# Altium project PCB_Project.PrjPcb
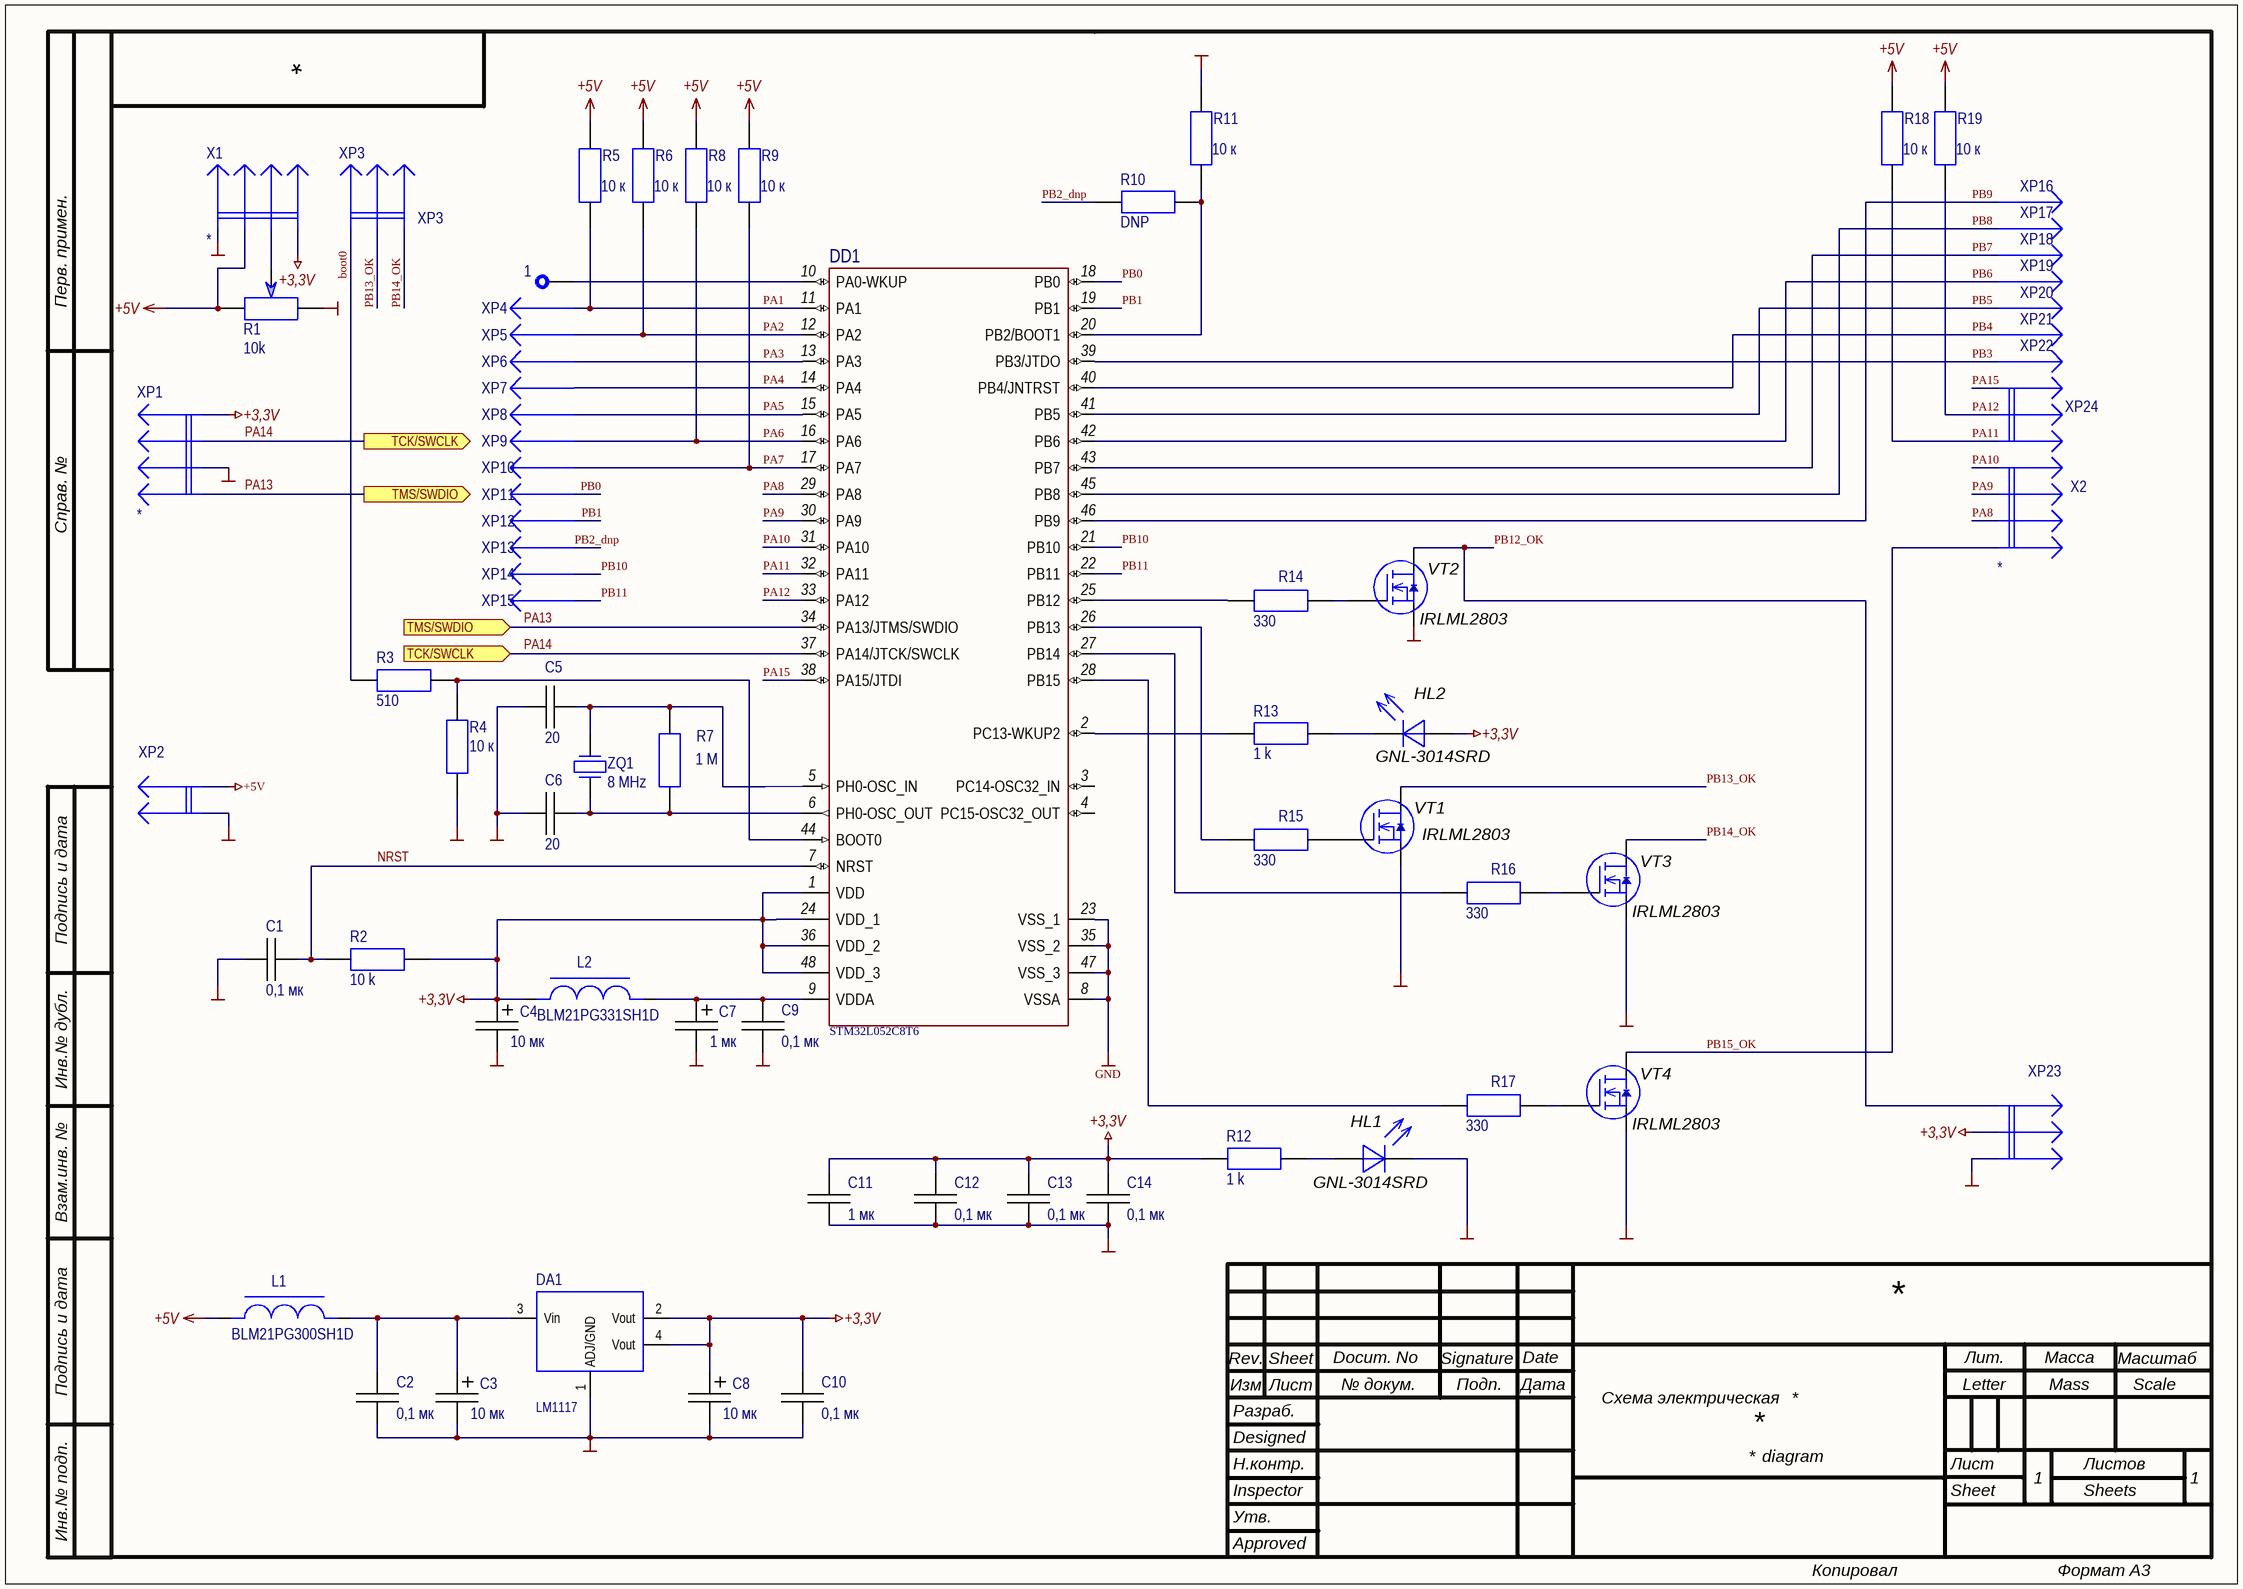
[diagram p0: DrillingL052.SchDoc]
1 sheet, 71 parts. Net scope: flat (ports and power ports of the same name join across sheets).
Board file: Stanok_driver.PcbDoc

## Sheet DrillingL052.SchDoc
size 420 x 297 mm; Date: 05.02.15; Organization: TCNIRT; SheetNumber: 1; SheetTotal: 1; PageSetup: Record=PageOptions|CenterHorizontal=False|CenterVertical=False|PrintScale=1.00|XCorrection=0.00|YCorrection=0.00|PrintKind=1|BorderSize=5000000|LeftOffset=0|BottomOffset=0|Orientation=1|PaperLength=1000|PaperWidth=1000|Scale=100|PaperSource=7|PrintQuality=300|MediaType=1|DitherType=10|PaperKind=A4|PrintScaleMode=0; CodeScheme: Э3; DocumentName: Панель

### Parts
1  PIN  [Hole]  (value not drawn)
C1  0,1 мк  [C0805]
C2  0,1 мк  [CAPC_1206]
C3  10 мк  [3216]
C4  10 мк  [3216]
C5  20  [CAPC_1206]
C6  20  [CAPC_1206]
C7  1 мк  [3216]
C8  10 мк  [3216]
C9  0,1 мк  [C0805]
C10  0,1 мк  [CAPC_1206]
C11  1 мк  [CAPC_1206]
C12  0,1 мк  [C0805]
C13  0,1 мк  [C0805]
C14  0,1 мк  [C0805]
DA1  LM1117  [SOT223]
DD1  STM32L052C8T6  [LQFP48_L]
HL1  GNL-3014SRD  [1206]
HL2  GNL-3014SRD  [1206]
L1  BLM21PG300SH1D  [C0805]
L2  BLM21PG331SH1D  [C0805]
R1  10k  [3296W]
R2  10 k  [RC0805-2]
R3  510  [RC0805-2]
R4  10 к  [RC0805-2]
R5  10 к  [RC0805-2]
R6  10 к  [RC0805-2]
R7  1 М  [SMD_1206]
R8  10 к  [RC0805-2]
R9  10 к  [RC0805-2]
R10  DNP  [RC0805-2]
R11  10 к  [RC0805-2]
R12  1 k  [RC0805-2]
R13  1 k  [RC0805-2]
R14  330  [RC0805-2]
R15  330  [RC0805-2]
R16  330  [RC0805-2]
R17  330  [RC0805-2]
R18  10 к  [RC0805-2]
R19  10 к  [RC0805-2]
VT1  IRLML2803  [SOT-23_N]
VT2  IRLML2803  [SOT-23_N]
VT3  IRLML2803  [SOT-23_N]
VT4  IRLML2803  [SOT-23_N]
X1  *  [PLS-4]
X2  *  [PLS-4]
XP1  *  [PLS-4]
XP2  XP2  [PLS-2]  (value not drawn)
XP3  XP3  [PLS-3]
XP4  (no value)  [Hole]
XP5  (no value)  [Hole]
XP6  (no value)  [Hole]
XP7  (no value)  [Hole]
XP8  (no value)  [Hole]
XP9  (no value)  [Hole]
XP10  (no value)  [Hole]
XP11  (no value)  [Hole]
XP12  (no value)  [Hole]
XP13  (no value)  [Hole]
XP14  (no value)  [Hole]
XP15  (no value)  [Hole]
XP16  (no value)  [Hole]
XP17  (no value)  [Hole]
XP18  (no value)  [Hole]
XP19  (no value)  [Hole]
XP20  (no value)  [Hole]
XP21  (no value)  [Hole]
XP22  (no value)  [Hole]
XP23  XP3  [PLS-3]  (value not drawn)
XP24  XP3  [PLS-3]  (value not drawn)
ZQ1  8 MHz  [HC-49U]

### Ports
TCK/SWCLK (in), TCK/SWCLK (out), TMS/SWDIO (in), TMS/SWDIO (out)

### Nets
+3,3V: C4.1(+) C8.1(+) C10.1 C11.1 C12.1 C13.1 C14.1 DA1.2(Vout) DA1.4(Vout) DD1.1(VDD) DD1.24(VDD_1) DD1.36(VDD_2) DD1.48(VDD_3) HL2.1(A) L2.1 R2.2 R12.1 X1.4 XP1.1 XP23.2
+5V: L1.1 R1.3 R5.2 R6.2 R8.2 R9.2 R18.2 R19.2 X1.2 XP2.1
GND: C1.1 C2.2 C3.2(-) C4.2(-) C5.1 C6.1 C7.2(-) C8.2(-) C9.2 C10.2 C11.2 C12.2 C13.2 C14.2 DA1.1(ADJ/GND) DD1.8(VSSA) DD1.23(VSS_1) DD1.35(VSS_2) DD1.47(VSS_3) HL1.2(K) R1.1 R4.2 R11.2 VT1.2(S) VT2.2(S) VT3.2(S) VT4.2(S) X1.1 XP1.3 XP2.2 XP23.3
boot0: R3.2 XP3.3
NRST: C1.2 DD1.7(NRST) R2.1
PA1: DD1.11(PA1) R5.1 XP4.1
PA2: DD1.12(PA2) R6.1 XP5.1
PA3: DD1.13(PA3) XP6.1
PA4: DD1.14(PA4) XP7.1
PA5: DD1.15(PA5) XP8.1
PA6: DD1.16(PA6) R8.1 XP9.1
PA7: DD1.17(PA7) R9.1 XP10.1
PA8: DD1.29(PA8) X2.3
PA9: DD1.30(PA9) X2.2
PA10: DD1.31(PA10) X2.1
PA11: DD1.32(PA11) R18.1 XP24.3
PA12: DD1.33(PA12) R19.1 XP24.2
PA13: DD1.34(PA13/JTMS/SWDIO) XP1.4 ; port TMS/SWDIO
PA14: DD1.37(PA14/JTCK/SWCLK) XP1.2 ; port TCK/SWCLK
PA15: DD1.38(PA15/JTDI) XP24.1
PB0: DD1.18(PB0) XP11.1
PB1: DD1.19(PB1) XP12.1
PB2_dnp: R10.1 XP13.1
PB3: DD1.39(PB3/JTDO) XP22.1
PB4: DD1.40(PB4/JNTRST) XP21.1
PB5: DD1.41(PB5) XP20.1
PB6: DD1.42(PB6) XP19.1
PB7: DD1.43(PB7) XP18.1
PB8: DD1.45(PB8) XP17.1
PB9: DD1.46(PB9) XP16.1
PB10: DD1.21(PB10) XP14.1
PB11: DD1.22(PB11) XP15.1
PB12_OK: VT2.3(D) XP23.1
PB13_OK: VT1.3(D) XP3.2
PB14_OK: VT3.3(D) XP3.1
PB15_OK: VT4.3(D) X2.4
Net1_1: 1.1 DD1.10(PA0-WKUP)
NetC2_1: C2.1 C3.1(+) DA1.3(Vin) L1.2
NetC5_2: C5.2 DD1.5(PH0-OSC_IN) R7.1 ZQ1.2
NetC6_2: C6.2 DD1.6(PH0-OSC_OUT) R7.2 ZQ1.1
NetC7_1: C7.1(+) C9.1 DD1.9(VDDA) L2.2
NetDD1_2: DD1.2(PC13-WKUP2) R13.1
NetDD1_20: DD1.20(PB2/BOOT1) R10.2 R11.1
NetDD1_25: DD1.25(PB12) R14.2
NetDD1_26: DD1.26(PB13) R15.2
NetDD1_27: DD1.27(PB14) R16.2
NetDD1_28: DD1.28(PB15) R17.2
NetDD1_44: DD1.44(BOOT0) R3.1 R4.1
NetHL1_1: HL1.1(A) R12.2
NetHL2_2: HL2.2(K) R13.2
NetR1_2: R1.2 X1.3
NetR14_1: R14.1 VT2.1(G)
NetR15_1: R15.1 VT1.1(G)
NetR16_1: R16.1 VT3.1(G)
NetR17_1: R17.1 VT4.1(G)

Not connected (* = marked no-connect by the designer): DD1 3(PC14-OSC32_IN) 4(PC15-OSC32_OUT)

### Notes on the sheet
- Перв. примен.
- Справ. №
- Подпись и дата
- Инв.№ дубл.
- Взам.инв. №
- Разраб.
- Изм
- Rev.
- Лист
- Sheet
- Docum. No
- № докум.
- Signature
- Подп.
- Date
- Дата
- Схема электрическая
- Лит.
- Letter
- Масса
- Mass
- Scale
- Масштаб
- Designed
- Н.контр.
- diagram
- Листов
- Инв.№ подп.
- Утв.
- Approved
- Inspector
- Sheets
- Копировал
- Формат А3

### Library data of the parts
1 = PIN: PIN, hole
C1 C2 C5 C6 C9-C14 = C: Capasitor; MarkPCB: *; Name: *
  C1: ValueSCH: 0,1 мк
  C2 C9 C10 C12-C14: ValueSCH: 0,1 мк; Part Number: C; Component Kind: Standard; Component Type: Standard; Designator: C; Footprint: K73-17; Pin Count: 2
  C5 C6: ValueSCH: 20
  C11: ValueSCH: 1 мк; Part Number: C; Component Kind: Standard; Component Type: Standard; Designator: C; Footprint: K73-17; Pin Count: 2
C3 C4 C7 C8 = CapPol: Capasitor_polar; Part Number: CapPol; Component Kind: Standard; Component Type: Standard; Designator: CapPol; Footprint: CapPolar; Pin Count: 2
  C3 C4 C8: ValueSCH: 10 мк
  C7: ValueSCH: 1 мк
DA1 = LM1117: Positive voltage regulators; Manufacturer: National Semiconductor; Корпус: SOT-223; ComponentLink1Description: Параметры; ComponentLink2Description: Сайт производителя; ComponentLink2URL: *; ManufacturerPartNumber: LM1117; Power\Voltage: *; Rem: *; TKE: *; Tolerance: *; TU/GOST: *; Value: *; Примечание: *; Mark: *
DD1 = STM32F103C8T6: STM32 ARM-based 32-bit MCU with 32 Kbytes Flash, 48-pin LQFP, Industrial Temperature; Published: 30-May-2008; DatasheetVersion: rev6, Mar-2008; PackageVersion: Mar-2008; PackageReference: LQFP48; Publisher: Altium Limited; PackageDescription: 48-Pin Low-Profile Quad Flat Pack, 7 x 7 mm Body, 0.5 mm Pitch (LQFP48); ComponentLink1Description: Manufacturer Link; ComponentLink1URL: www.st.com/stm32; ComponentLink2Description: Datasheet; ComponentLink2URL: http://www.st.com/stonline/products/literature/ds/13587.pdf
HL1 HL2 = GNL-3014RED: ValueBOM: Диод GNL-3014SRD; Type: VD; Part Number: GNL-3014RED; Value: GNL-3014SRD; ComponentLink1URL: E:\BaseComponent_TCNIRT\PDF\GNL-3014.pdf; ComponentLink1Description: Datasheet; Date: 01.10.2019
L1 L2 = B: Ferrite bead; datasheet: *
  L1: Value: BLM21PG300SH1D
  L2: Value: BLM21PG331SH1D
R1 = Res_trimmer: 3296W; Value: 10k; ComponentLink1URL: *; ManufacturerPartNumber: *; Supplier Part Number 1: *; ComponentLink1Description: Параметры; Manufacturer: *; Power\Voltage: *; Tolerance: *; ComponentLink2URL: *; TU/GOST: *; Корпус: *; Примечание: *; ComponentLink2Description: Сайт протзводителя; ValueSCH: *; Name: 3296W
R2-R19 = R_Gost: Resistor,2 Pin; ValueBOM: *; MarkPCB: *
  R2: ValueSCH: 10 k
  R3: ValueSCH: 510
  R4-R6 R8 R9 R11 R18 R19: ValueSCH: 10 к
  R7: ValueSCH: 1 М
  R10: ValueSCH: DNP
  R12 R13: ValueSCH: 1 k
  R14-R17: ValueSCH: 330
VT1-VT4 = IRLML2803: Manufacturer: Intarnational Rectifier; ValueBOM: Транзистор IRLML2803; Type: VT; Part Number: IRLML2803; Value: IRLML2803; ComponentLink1URL: E:\BaseComponent_TCNIRT\PDF\irlml2803pbf.pdf; ComponentLink1Description: Datasheet; Date: 01.10.2019
X1 X2 XP1 = XP4: Value: *
XP4-XP22 = XP_1: PIN, hole
ZQ1 = OSC: Value: 8 MHz; ManufacturerPartNumber: *; ComponentLink1URL: D:\datasheet\Кварцы\00688.pdf; Manufacturer: *
XP2 = XP2: Value: *
XP3 XP23 XP24 = XP3: Value: *